# Altium schematic sheet Control.SchDoc: μC, Power scheme, RF
size A4; SheetNumber: 1; SheetTotal: 2
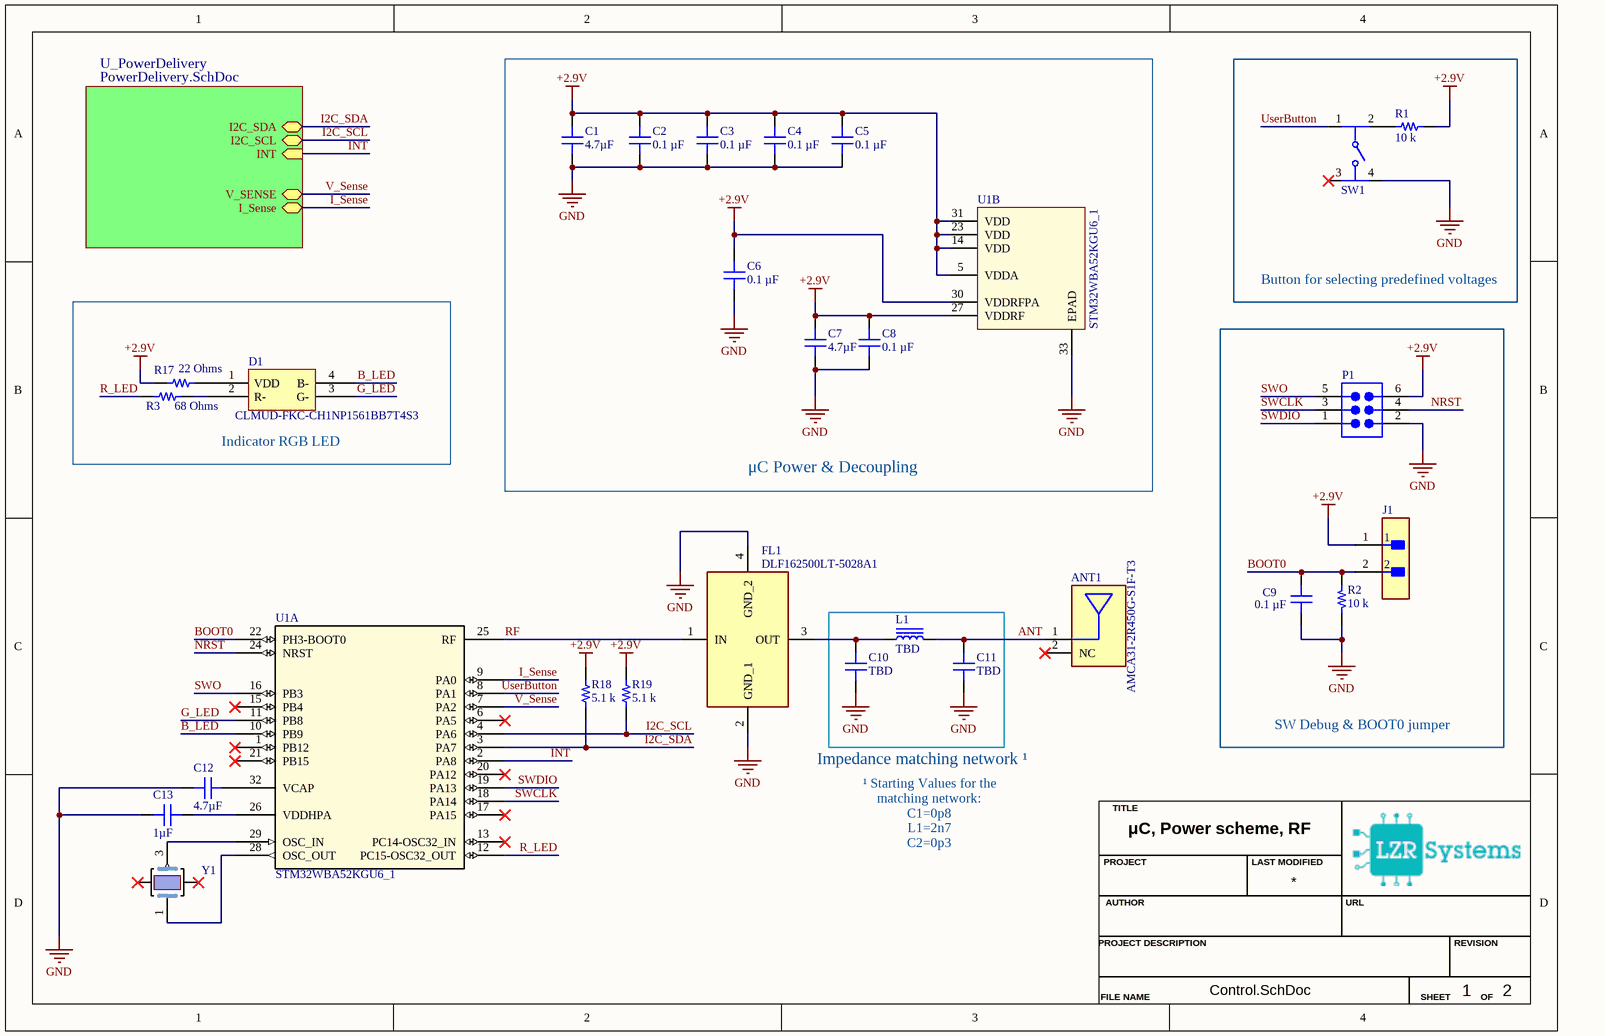
[diagram p0: Control.SchDoc]

## Parts
ANT1  AMCA31-2R450G-S1F-T3  [FP-AMCA31-MFG]
C1  4.7µF  [CAP 0805_2012]
C2  0.1 µF  [CAP 0805_2012]
C3  0.1 µF  [CAP 0805_2012]
C4  0.1 µF  [CAP 0805_2012]
C5  0.1 µF  [CAP 0805_2012]
C6  0.1 µF  [CAP 0805_2012]
C7  4.7µF  [CAP 0805_2012]
C8  0.1 µF  [CAP 0805_2012]
C9  0.1 µF  [CAP 0805_2012]
C10  Capacitance: TBD  [CAP 0402_1005]  (hidden comment: 3.6 pF)
C11  Capacitance: TBD  [CAP 0402_1005]  (hidden comment: 3.6 pF)
C12  4.7µF  [CAP 0805_2012]
C13  1µF  [CAP 0805_2012]
D1  CLMUD-FKC-CH1NP1561BB7T4S3  [SON70P150X100-4N]
FL1  DLF162500LT-5028A1  [DLF162500LT5028A1]
J1  TSW-102-12-T-S  [FP-TSW-102-12-T-S-MFG]  (value not drawn)
L1  TBD  [IND 0402_1005]
P1  MTLW-103-06-G-D-180  [SMTC-MTLW-103-06-X-D-180]  (value not drawn)
R1  10 k  [RES 0805_2012]
R2  10 k  [RES 0805_2012]
R3  68 Ohms  [YAGEO RES 0805_2012]
R17  22 Ohms  [RES 0805_2012]
R18  5.1 k  [YAGEO RES 0805_2012]
R19  5.1 k  [YAGEO RES 0805_2012]
SW1  TL1105AF160Q  [FP-TL1105AF160Q-MFG]  (value not drawn)
U1  STM32WBA52KGU6_1  [UFQFPN-32_STM]  (parts A,B of 2)
Y1  XRCGB32M000F2P01R0  [XRCGB]  (value not drawn)

## Blocks framed on the sheet
μC Power & Decoupling: C1-C8 U1
Button for selecting predefined voltages: R1 SW1
Indicator RGB LED: D1 R3 R17
SW Debug & BOOT0 jumper: C9 J1 P1 R2

## Sub-sheets
U_PowerDelivery = PowerDelivery.SchDoc: I2C_SDA (bidir), I2C_SCL (bidir), INT (in), I_Sense (bidir), V_SENSE (bidir)

## Nets
+2.9V: C1.2 C2.2 C3.2 C4.2 C5.2 C6.2 C7.2 C8.2 J1.1 P1.6 R1.2 R17.2 R18.2 R19.2 U1.5(VDDA) U1.14(VDD) U1.23(VDD) U1.27(VDDRF) U1.30(VDDRFPA) U1.31(VDD)
GND: C1.1 C2.1 C3.1 C4.1 C5.1 C6.1 C7.1 C8.1 C9.1 C10.1 C11.1 C12.1 C13.2 FL1.2(GND_1) FL1.4(GND_2) P1.2 R2.1 SW1.4 U1.33(EPAD)
ANT: ANT1.1(Feed_Point) C11.2 L1.2
B_LED: D1.4(B-) U1.10(PB9)
BOOT0: C9.2 J1.2 R2.2 U1.22(PH3-BOOT0)
G_LED: D1.3(G-) U1.11(PB8)
I2C_SCL: R19.1 U1.4(PA6) ; sheet U_PowerDelivery/I2C_SCL
I2C_SDA: R18.1 U1.3(PA7) ; sheet U_PowerDelivery/I2C_SDA
I_Sense: U1.9(PA0) ; sheet U_PowerDelivery/I_Sense
INT: U1.2(PA8) ; sheet U_PowerDelivery/INT
NRST: P1.4 U1.24(NRST)
R_LED: R3.1 U1.12(PC15-OSC32_OUT)
RF: FL1.1(IN) U1.25(RF)
SWCLK: P1.3 U1.18(PA14)
SWDIO: P1.1 U1.19(PA13)
SWO: P1.5 U1.16(PB3)
UserButton: SW1.1 U1.8(PA1)
V_Sense: U1.7(PA2) ; sheet U_PowerDelivery/V_SENSE
NetC10_2: C10.2 FL1.3(OUT) L1.1
NetC12_2: C12.2 U1.32(VCAP)
NetC13_1: C13.1 U1.26(VDDHPA)
NetD1_1: D1.1(VDD) R17.1
NetD1_2: D1.2(R-) R3.2
NetR1_1: R1.1 SW1.2
NetU1_28: U1.28(OSC_OUT) Y1.1(XTAL_1)
NetU1_29: U1.29(OSC_IN) Y1.3(XTAL_2)

Not connected (* = marked no-connect by the designer): ANT1 2(NC)*; SW1 3*; U1 1(PB12)* 6(PA5)* 13(PC14-OSC32_IN)* 15(PB4)* 17(PA15)* 20(PA12)* 21(PB15)*; Y1 2(NC_1)* 4*

## Notes on the sheet
- Impedance matching network ¹
- ¹ Starting Values for the matching network:
  C1=0p8
  L1=2n7
  C2=0p3
- TITLE
- AUTHOR
- PROJECT
- LAST MODIFIED
- URL
- PROJECT DESCRIPTION
- REVISION
- FILE NAME
- SHEET
- OF

## Library data of the parts
ANT1 = CMP-00025-00003-1: Chip Dielectric Antenna; 1dBi; 2450MHz; T/R; Frequency: 2.45GHz; Mounting Technology: Surface Mount; Max Operating Temperature: 85°C; Min Operating Temperature: -40°C; Case/Package: SMD/SMT
C1 C7 C12 = 0805ZD475KAT2A: CAP CER 4.7UF 10V X5R 0805; manufacturer: AVX Corporation; Tolerance: ±10%; Part Number: 0805ZD475KAT2A; Capacitance: 4.7µF; Applications: General Purpose; componentlink1description: Datasheet; componentlink1url: http://datasheets.avx.com/cx5r.pdf; componentlink2description: DigiKey Link; componentlink2url: http://digikey.com/product-detail/en/avx-corporation/0805ZD475KAT2A/478-1415-1-ND/564447; Device Package: 0805 (2012 Metric); lastupdated: 9/2/2020 1:04:40 AM; Lifecycle Status: Active; Minimum Order: 1; Mounting Type: Surface Mount, MLCC; Operating Temperature: -55°C ~ 85°C; Package / Case: 0805 (2012 Metric); packaging: TapeAndReel; partid: 3139; Part Status: Active; price: 0.12; series: -; Size / Dimension: 0.079" L x 0.049" W (2.01mm x 1.25mm); Supplier 1: DigiKey; Supplier Part Number 1: 478-1415-1-ND; Temperature Coefficient: X5R; Thickness (Max): 0.055" (1.40mm); value: 4.7µF; Voltage - Rated: 10V
C2-C6 C8 C9 = KGM21NR71H104MT: CAP CER 0.1UF 50V X7R 0805; manufacturer: KYOCERA AVX; Tolerance: ±20%; Part Number: KGM21NR71H104MT; Capacitance: 0.1 µF; Applications: General Purpose; componentlink1description: Datasheet; componentlink1url: https://datasheets.kyocera-avx.com/X7RDielectric.pdf; componentlink2description: DigiKey Link; componentlink2url: https://www.digikey.com/en/products/detail/kyocera-avx/KGM21NR71H104MT/929983; Device Package: 0805 (2012 Metric); lastupdated: 2/9/2024 8:14:06 PM; Lifecycle Status: Active; Minimum Order: 1; Mounting Type: Surface Mount, MLCC; Operating Temperature: -55°C ~ 125°C; Package / Case: 0805 (2012 Metric); packaging: TapeAndReel; partid: 53901; Part Status: Active; price: 0.01; series: KGM - X7R; Size / Dimension: 0.079" L x 0.049" W (2.01mm x 1.25mm); Supplier 1: DigiKey; Supplier Part Number 1: 478-KGM21NR71H104MTCT-ND; Temperature Coefficient: X7R; Thickness (Max): 0.039" (1.00mm); value: 0.1 µF; Voltage - Rated: 50V
C10 C11 = 600L3R6AT200T: CAP CER 3.6PF 200V C0G/NP0 0402; manufacturer: American Technical Ceramics; Temperature Coefficient: C0G, NP0; Tolerance: ±0.05pF; Part Number: 600L3R6AT200T; Applications: RF, Microwave, High Frequency, Bypass, Decoupling; componentlink1description: Datasheet; componentlink1url: http://www.atceramics.com/UserFiles/600l.pdf; componentlink2description: DigiKey Link; componentlink2url: https://www.digikey.com/en/products/detail/american-technical-ceramics/600L3R6AT200T/3905167; Device Package: 0402 (1005 Metric); Features: High Q, Low Loss, Ultra Low ESR; lastupdated: 2/9/2024 8:04:37 PM; Lifecycle Status: Active; Minimum Order: 1; Mounting Type: Surface Mount, MLCC; Operating Temperature: -55°C ~ 125°C; Package / Case: 0402 (1005 Metric); packaging: TapeAndReel; partid: 2064; Part Status: Active; price: 0.49; series: ATC 600L; Size / Dimension: 0.040" L x 0.020" W (1.02mm x 0.51mm); Supplier 1: DigiKey; Supplier Part Number 1: 1284-1126-1-ND; Thickness (Max): 0.024" (0.60mm); value: 3.6 pF; Voltage - Rated: 200V
C13 = 08053C105KAT2A: CAP CER 1UF 25V X7R 0805; manufacturer: AVX Corporation; Tolerance: ±10%; Part Number: 08053C105KAT2A; Capacitance: 1µF; Applications: General Purpose; componentlink1description: Datasheet; componentlink1url: http://datasheets.avx.com/X7RDielectric.pdf; componentlink2description: DigiKey Link; componentlink2url: http://digikey.com/product-detail/en/avx-corporation/08053C105KAT2A/478-5030-1-ND/1888241; Device Package: 0805 (2012 Metric); lastupdated: 9/2/2020 1:04:33 AM; Lifecycle Status: Active; Minimum Order: 1; Mounting Type: Surface Mount, MLCC; Operating Temperature: -55°C ~ 125°C; Package / Case: 0805 (2012 Metric); packaging: TapeAndReel; partid: 7289; Part Status: Active; price: 0.04; series: -; Size / Dimension: 0.079" L x 0.049" W (2.01mm x 1.25mm); Supplier 1: DigiKey; Supplier Part Number 1: 478-5030-1-ND; Temperature Coefficient: X7R; Thickness (Max): 0.037" (0.94mm); value: 1µF; Voltage - Rated: 25V
D1 = CMP-007-00044-3: Cree LED RGB LED Common Annode If=10mA Vf = 1.9/2.6/2.7
FL1 = DLF162500LT-5028A1: Filter; Manufacturer_Name: TDK; Datasheet Link: https://product.tdk.com/system/files/dam/doc/product/rf/rf/filter/catalog/rf_lpf_dlf162500lt-5028a1_en.pdf; Height: 0.4mm; Manufacturer_Part_Number: DLF162500LT-5028A1; Mouser Part Number: 810-DLF16250LT5028A1; Mouser Price/Stock: https://www.mouser.co.uk/ProductDetail/TDK/DLF162500LT-5028A1?qs=U%2FZX79kHR%2FlwIbAISCs3qA%3D%3D; Arrow Part Number: DLF162500LT-5028A1; Arrow Price/Stock: https://www.arrow.com/en/products/dlf162500lt-5028a1/tdk?utm_currency=USD&region=nac
J1 = CMP-002-00077-1: Pin Header, Board-to-Board, 2.54 mm, 1 Rows, 2 Contacts, Through Hole, TSW Series; Voltage Rating: 550V; Gender: Male; Min Operating Temperature: -55°C; Max Operating Temperature: 105°C; Mounting Technology: Through Hole
L1 = LQG15HS3N9C02D: FIXED IND 3.9NH 750MA 140MOHM SM; Manufacturer: Murata Electronics; DC Resistance (DCR): 140mOhm Max; Frequency - Self Resonant: 6GHz; Inductance Frequency - Test: 100 MHz; Material - Core: Air; Shielding: Unshielded; Tolerance: ±0.2nH; Type: Multilayer; Part Number: LQG15HS3N9C02D; ComponentLink1Description: Datasheet; ComponentLink1URL: https://search.murata.co.jp/Ceramy/image/img/P02/JELF243B-0010.pdf; ComponentLink2Description: DigiKey Link; ComponentLink2URL: https://www.digikey.com/en/products/detail/murata-electronics/LQG15HS3N9C02D/6798548; Current Rating (Amps): 750 mA; Device Package: 0402 (1005 Metric); Height - Seated (Max): 0.022" (0.55mm); Inductance: 3.9 nH; LastUpdated: 6/3/2024 8:13:02 PM; Lifecycle Status: Active; Minimum Order: 1; Mounting Type: Surface Mount; Operating Temperature: -55°C ~ 125°C; Package / Case: 0402 (1005 Metric); Packaging: TapeAndReel; PartId: 2221; Part Status: Active; Price: 0.02; Series: LQG15; Size / Dimension: 0.039" L x 0.020" W (1.00mm x 0.50mm); Supplier 1: DigiKey; Supplier Part Number 1: 490-15123-1-ND; Supplier Device Package: 0402 (1005 Metric); Value: 3.9 nH
P1 = CMP-002-00079-1: Pin Header, Board-to-Board, 2.54 mm, 2 Rows, 6 Contacts, Through Hole, MTLW Series; Max Operating Temperature: 125°C; Min Operating Temperature: -55°C
R1 R2 = RNCS0805BKE10K0: RES 10K OHM 0.1% 1/10W 0805; Manufacturer: Stackpole Electronics Inc; Power (Watts): 0.1W, 1/10W; Resistance: 10 kOhms; Temperature Coefficient: ±25ppm/°C; Part Number: RNCS0805BKE10K0; Value: 10 k; ComponentLink1Description: Datasheet; ComponentLink1URL: https://www.seielect.com/catalog/sei-rncs_rnch.pdf; ComponentLink2Description: DigiKey Link; ComponentLink2URL: https://www.digikey.com/en/products/detail/stackpole-electronics-inc/RNCS0805BKE10K0/1800067; Composition: Thin Film; Device Package: 0805 (2012 Metric); Features: Anti-Corrosive, Automotive AEC-Q200, Moisture Resistant; Height - Seated (Max): 0.026" (0.65mm); LastUpdated: 2/8/2024 9:02:39 PM; Lifecycle Status: Active; Minimum Order: 1; Number of Terminations: 2; Operating Temperature: -55°C ~ 155°C; Package / Case: 0805 (2012 Metric); Packaging: TapeAndReel; PartId: 27713; Part Status: Active; Price: 0.07; Ratings: AEC-Q200; Series: RNCS; Size / Dimension: 0.079" L x 0.049" W (2.00mm x 1.25mm); Supplier 1: DigiKey; Supplier Part Number 1: RNCS0805BKE10K0CT-ND; Supplier Device Package: 0805; Tolerance: ±0.1%
R3 = RC0805FR-0768R1L: RES 68.1 OHM 1% 1/8W 0805; Manufacturer: Yageo; Power (Watts): 0.125W, 1/8W; Resistance: 68.1 Ohms; Temperature Coefficient: ±100ppm/°C; Part Number: RC0805FR-0768R1L; Value: 68 Ohms; ComponentLink1Description: Datasheet; ComponentLink1URL: https://www.yageo.com/upload/media/product/productsearch/datasheet/rchip/PYu-RC_Group_51_RoHS_L_10.pdf; ComponentLink2Description: DigiKey Link; ComponentLink2URL: https://www.digikey.com/en/products/detail/yageo/RC0805FR-0768R1L/728099; Composition: Thick Film; Device Package: 0805 (2012 Metric); Features: Moisture Resistant; Height - Seated (Max): 0.024" (0.60mm); LastUpdated: 7/25/2024 9:20:18 AM; Lifecycle Status: Active; Minimum Order: 1; Number of Terminations: 2; Operating Temperature: -55°C ~ 155°C; Package / Case: 0805 (2012 Metric); Packaging: TapeAndReel; PartId: 44821; Part Status: Active; Price: 0.01; Series: RC_L; Size / Dimension: 0.079" L x 0.049" W (2.00mm x 1.25mm); Supplier 1: DigiKey; Supplier Part Number 1: 311-68.1CRCT-ND; Supplier Device Package: 0805; Tolerance: ±1%
R17 = SFR10EZPJ220: RES 22 OHM 5% 1/8W 0805; Manufacturer: Rohm Semiconductor; Power (Watts): 0.125W, 1/8W; Temperature Coefficient: ±200ppm/°C; Part Number: SFR10EZPJ220; Value: 22 Ohms; ComponentLink1Description: Datasheet; ComponentLink1URL: https://fscdn.rohm.com/en/products/databook/datasheet/passive/resistor/chip_resistor/sfr-e.pdf; ComponentLink2Description: DigiKey Link; ComponentLink2URL: https://www.digikey.com/en/products/detail/rohm-semiconductor/SFR10EZPJ220/17944490; Composition: Thick Film; Device Package: 0805 (2012 Metric); Features: Anti-Sulfur, Automotive AEC-Q200; Height - Seated (Max): 0.026" (0.65mm); LastUpdated: 2/8/2024 9:00:13 PM; Lifecycle Status: Active; Minimum Order: 1; Number of Terminations: 2; Operating Temperature: -55°C ~ 155°C; Package / Case: 0805 (2012 Metric); Packaging: TapeAndReel; PartId: 73570; Part Status: Active; Price: 0.01; Ratings: AEC-Q200; Resistance: 22 Ohms; Series: SFR; Size / Dimension: 0.079" L x 0.049" W (2.00mm x 1.25mm); Supplier 1: DigiKey; Supplier Part Number 1: 511-SFR10EZPJ220CT-ND; Supplier Device Package: 0805; Tolerance: ±5%
R18 R19 = RT0805BRD075K1L: RES SMD 5.1K OHM 0.1% 1/8W 0805; Manufacturer: Yageo; Power (Watts): 0.125W, 1/8W; Resistance: 5.1 kOhms; Temperature Coefficient: ±25ppm/°C; Part Number: RT0805BRD075K1L; Value: 5.1 k; ComponentLink1Description: Datasheet; ComponentLink1URL: https://www.yageo.com/upload/media/product/productsearch/datasheet/rchip/PYu-RT_1-to-0.01_RoHS_L_11.pdf; ComponentLink2Description: DigiKey Link; ComponentLink2URL: https://www.digikey.com/en/products/detail/yageo/RT0805BRD075K1L/1075977; Composition: Thin Film; Device Package: 0805 (2012 Metric); Height - Seated (Max): 0.024" (0.60mm); LastUpdated: 7/25/2024 9:20:25 AM; Lifecycle Status: Active; Minimum Order: 1; Number of Terminations: 2; Operating Temperature: -55°C ~ 155°C; Package / Case: 0805 (2012 Metric); Packaging: TapeAndReel; PartId: 32968; Part Status: Active; Price: 0.04; Series: RT; Size / Dimension: 0.079" L x 0.049" W (2.00mm x 1.25mm); Supplier 1: DigiKey; Supplier Part Number 1: YAG1938CT-ND; Supplier Device Package: 0805; Tolerance: ±0.1%
SW1 = CMP-011-00014-1: Switch Tactile N.O. SPST Round Button PC Pins 0.05A 50VDC 1.57N Thru-Hole; Current Rating: 50mA; Throw Configuration: SPST; Mounting Technology: Through Hole; Min Operating Temperature: -20°C; Max Current Rating: 50mA; Max Operating Temperature: 70°C
U1 = CMP-031-00007-6: Ultra-low-power, Arm Cortex-M33 Trust Zone MCU 100 MHz with 1 Mbyte of Flash memory,  Bluetooth LE 5.4; Manufacturer_Name: STMicroelectronics; Type: Type; Source: STM32WBA52KGU6.SchLib; Design Item ID: STM32WBA52KGU6_1; Manufacturer_Part_Number: STM32WBA52KGU6; Datasheet: https://www.st.com/resource/en/datasheet/stm32wba52ce.pdf; RefDes: RefDes; Copyright: Copyright (C) 2025 Ultra Librarian. All rights reserved.; Component Type: Standard; Pins: 33
Y1 = XRCGB32M000F2P01R0: Crystal or Oscillator; Manufacturer_Name: Murata Electronics; Datasheet Link: https://www.murata.com/products/productdata/8801065500702/SPEC-XRCGB32M000F2P01R0.pdf; Height: 0.7mm; Manufacturer_Part_Number: XRCGB32M000F2P01R0; Mouser Part Number: 81-XRCGB32M000F2P01R; Mouser Price/Stock: https://www.mouser.co.uk/ProductDetail/Murata-Electronics/XRCGB32M000F2P01R0?qs=rrS6PyfT74czmgr%252Bqfmsyw%3D%3D; Arrow Part Number: XRCGB32M000F2P01R0; Arrow Price/Stock: https://www.arrow.com/en/products/xrcgb32m000f2p01r0/murata-manufacturing?region=nac